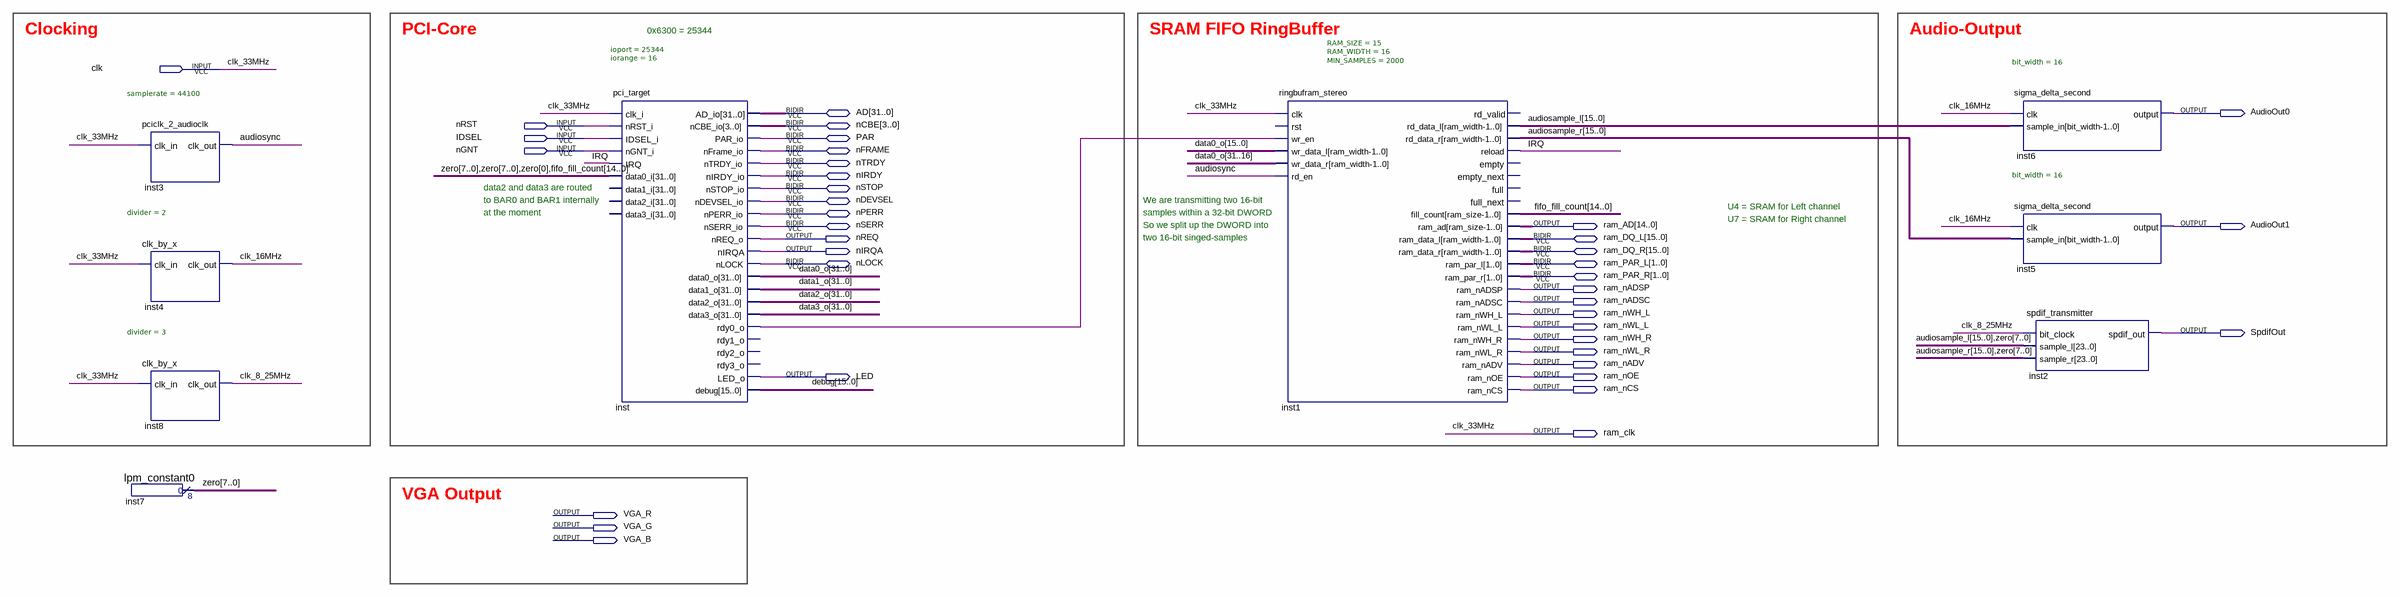
[diagram p0: schematic sheet]
// Quartus schematic PCICard.bdf as structural Verilog: 9 symbols, 39 pins
module PCICard (
  input  clk,
  input  nRST,
  input  IDSEL,
  input  nGNT,
  inout  [31:0] AD,
  inout  [3:0] nCBE,
  inout  PAR,
  inout  nFRAME,
  inout  nTRDY,
  inout  nIRDY,
  inout  nSTOP,
  inout  nDEVSEL,
  inout  nPERR,
  inout  nSERR,
  inout  [15:0] ram_DQ_L,
  inout  [15:0] ram_DQ_R,
  inout  nLOCK,
  inout  [1:0] ram_PAR_L,
  inout  [1:0] ram_PAR_R,
  output AudioOut0,
  output [14:0] ram_AD,
  output AudioOut1,
  output nREQ,
  output nIRQA,
  output ram_nADSP,
  output ram_nADSC,
  output ram_nWH_L,
  output ram_nWL_L,
  output SpdifOut,
  output ram_nWH_R,
  output ram_nWL_R,
  output ram_nADV,
  output LED,
  output ram_nOE,
  output ram_nCS,
  output ram_clk,
  output VGA_R,
  output VGA_G,
  output VGA_B
);

  wire audiosync, clk_8_25MHz, clk_16MHz, inst_rdy0_o, IRQ;
  wire [7:0] zero;
  wire [14:0] fifo_fill_count;
  wire [15:0] audiosample_l, audiosample_r, debug;
  wire [31:0] data0_o, data1_o, data2_o, data3_o;

  lpm_constant0 inst7 (.result(zero));
  pciclk_2_audioclk #(.samplerate(44100)) inst3 (.clk_in(clk), .clk_out(audiosync));
  clk_by_x #(.divider(2)) inst4 (.clk_in(clk), .clk_out(clk_16MHz));
  clk_by_x #(.divider(3)) inst8 (.clk_in(clk), .clk_out(clk_8_25MHz));
  pci_target #(.ioport(25344), .iorange(16)) inst (
    .clk_i(clk), .nRST_i(nRST), .IDSEL_i(IDSEL), .nGNT_i(nGNT), .IRQ(IRQ),
    .data0_i({zero, zero, zero[0], fifo_fill_count}), .nREQ_o(nREQ), .nIRQA(nIRQA), .data0_o(data0_o),
    .data1_o(data1_o), .data2_o(data2_o), .data3_o(data3_o), .rdy0_o(inst_rdy0_o), .LED_o(LED),
    .debug(debug), .AD_io(AD), .nCBE_io(nCBE), .PAR_io(PAR), .nFrame_io(nFRAME), .nTRDY_io(nTRDY),
    .nIRDY_io(nIRDY), .nSTOP_io(nSTOP), .nDEVSEL_io(nDEVSEL), .nPERR_io(nPERR), .nSERR_io(nSERR),
    .nLOCK(nLOCK));  // open: data1_i, data2_i, data3_i, rdy1_o, rdy2_o, rdy3_o
  ringbufram_stereo #(.RAM_SIZE(15), .RAM_WIDTH(16), .MIN_SAMPLES(2000)) inst1 (
    .clk(clk), .wr_en(inst_rdy0_o), .wr_data_l(data0_o[15:0]), .wr_data_r(data0_o[31:16]), .rd_en(audiosync),
    .rd_data_l(audiosample_l), .rd_data_r(audiosample_r), .reload(IRQ), .fill_count(fifo_fill_count),
    .ram_ad(ram_AD), .ram_nADSP(ram_nADSP), .ram_nADSC(ram_nADSC), .ram_nWH_L(ram_nWH_L),
    .ram_nWL_L(ram_nWL_L), .ram_nWH_R(ram_nWH_R), .ram_nWL_R(ram_nWL_R), .ram_nADV(ram_nADV),
    .ram_nOE(ram_nOE), .ram_nCS(ram_nCS), .ram_data_l(ram_DQ_L), .ram_data_r(ram_DQ_R),
    .ram_par_l(ram_PAR_L), .ram_par_r(ram_PAR_R));  // open: rst, rd_valid, empty, empty_next, full, full_next
  sigma_delta_second #(.bit_width(16)) inst6 (.clk(clk_16MHz), .sample_in(audiosample_l), .\output (AudioOut0));
  sigma_delta_second #(.bit_width(16)) inst5 (.clk(clk_16MHz), .sample_in(audiosample_r), .\output (AudioOut1));
  spdif_transmitter inst2 (
    .bit_clock(clk_8_25MHz), .sample_l({audiosample_l, zero}), .sample_r({audiosample_r, zero}),
    .spdif_out(SpdifOut));

  assign ram_clk = clk;

  // Other names for the same wires on the sheet: clk_33MHz = clk

  // Notes on the sheet:
  //   Clocking
  //   PCI-Core
  //   SRAM FIFO RingBuffer
  //   Audio-Output
  //   0x6300 = 25344
  //   data2 and data3 are routed
  //   to BAR0 and BAR1 internally
  //   We are transmitting two 16-bit
  //   U4 = SRAM for Left channel
  //   at the moment
  //   samples within a 32-bit DWORD
  //   U7 = SRAM for Right channel
  //   So we split up the DWORD into
  //   two 16-bit singed-samples
  //   VGA Output
endmodule
